# EAGLE design EIB32-JAE-HPC-v1 (EAGLE 9.4.2)
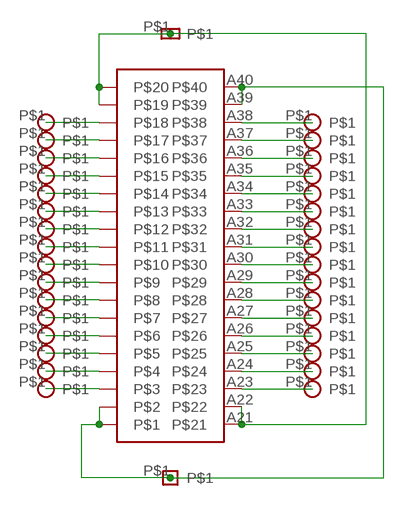
[diagram p0: schematic, sheet 1]

## Parts
U$1  WR-40SB-VFH30  [WR-40SB-VFH30]
U$2  EIB-GND-HOLE-PAD-SMALL  [EIB-GND-HOLE-PAD-SMALL]
U$3  EIB-GND-HOLE-PAD  [EIB-GND-HOLE-PAD]
U$5  EIB-TETRODE-HOLE-RS-PAD  [EIB-TETRODE-HOLE-RS-PAD]
U$6  EIB-TETRODE-HOLE-RS-PAD  [EIB-TETRODE-HOLE-RS-PAD]
U$7  EIB-TETRODE-HOLE-RS-PAD  [EIB-TETRODE-HOLE-RS-PAD]
U$8  EIB-TETRODE-HOLE-RS-PAD  [EIB-TETRODE-HOLE-RS-PAD]
U$9  EIB-TETRODE-HOLE-RS-PAD  [EIB-TETRODE-HOLE-RS-PAD]
U$10  EIB-TETRODE-HOLE-RS-PAD  [EIB-TETRODE-HOLE-RS-PAD]
U$11  EIB-TETRODE-HOLE-RS-PAD  [EIB-TETRODE-HOLE-RS-PAD]
U$12  EIB-TETRODE-HOLE-RS-PAD  [EIB-TETRODE-HOLE-RS-PAD]
U$13  EIB-TETRODE-HOLE-RS-PAD  [EIB-TETRODE-HOLE-RS-PAD]
U$14  EIB-TETRODE-HOLE-RS-PAD  [EIB-TETRODE-HOLE-RS-PAD]
U$15  EIB-TETRODE-HOLE-RS-PAD  [EIB-TETRODE-HOLE-RS-PAD]
U$16  EIB-TETRODE-HOLE-RS-PAD  [EIB-TETRODE-HOLE-RS-PAD]
U$17  EIB-TETRODE-HOLE-RS-PAD  [EIB-TETRODE-HOLE-RS-PAD]
U$18  EIB-TETRODE-HOLE-RS-PAD  [EIB-TETRODE-HOLE-RS-PAD]
U$19  EIB-TETRODE-HOLE-RS-PAD  [EIB-TETRODE-HOLE-RS-PAD]
U$20  EIB-TETRODE-HOLE-RS-PAD  [EIB-TETRODE-HOLE-RS-PAD]
U$23  EIB-TETRODE-HOLE-RS-PAD  [EIB-TETRODE-HOLE-RS-PAD]
U$24  EIB-TETRODE-HOLE-RS-PAD  [EIB-TETRODE-HOLE-RS-PAD]
U$25  EIB-TETRODE-HOLE-RS-PAD  [EIB-TETRODE-HOLE-RS-PAD]
U$26  EIB-TETRODE-HOLE-RS-PAD  [EIB-TETRODE-HOLE-RS-PAD]
U$27  EIB-TETRODE-HOLE-RS-PAD  [EIB-TETRODE-HOLE-RS-PAD]
U$28  EIB-TETRODE-HOLE-RS-PAD  [EIB-TETRODE-HOLE-RS-PAD]
U$29  EIB-TETRODE-HOLE-RS-PAD  [EIB-TETRODE-HOLE-RS-PAD]
U$30  EIB-TETRODE-HOLE-RS-PAD  [EIB-TETRODE-HOLE-RS-PAD]
U$31  EIB-TETRODE-HOLE-RS-PAD  [EIB-TETRODE-HOLE-RS-PAD]
U$32  EIB-TETRODE-HOLE-RS-PAD  [EIB-TETRODE-HOLE-RS-PAD]
U$33  EIB-TETRODE-HOLE-RS-PAD  [EIB-TETRODE-HOLE-RS-PAD]
U$34  EIB-TETRODE-HOLE-RS-PAD  [EIB-TETRODE-HOLE-RS-PAD]
U$35  EIB-TETRODE-HOLE-RS-PAD  [EIB-TETRODE-HOLE-RS-PAD]
U$36  EIB-TETRODE-HOLE-RS-PAD  [EIB-TETRODE-HOLE-RS-PAD]
U$37  EIB-TETRODE-HOLE-RS-PAD  [EIB-TETRODE-HOLE-RS-PAD]
U$38  EIB-TETRODE-HOLE-RS-PAD  [EIB-TETRODE-HOLE-RS-PAD]

## Nets
N$1: U$1.A19 U$1.A20 U$1.A21 U$1.A22 U$2.P$1
N$3: U$1.A1 U$1.A2 U$1.A39 U$1.A40 U$3.P$1
N$6: U$1.A18 U$5.P$1
N$7: U$1.A17 U$6.P$1
N$8: U$1.A16 U$7.P$1
N$9: U$1.A15 U$8.P$1
N$10: U$1.A14 U$9.P$1
N$11: U$1.A13 U$10.P$1
N$12: U$1.A12 U$11.P$1
N$13: U$1.A11 U$12.P$1
N$14: U$1.A10 U$13.P$1
N$15: U$1.A9 U$14.P$1
N$16: U$1.A8 U$15.P$1
N$17: U$1.A7 U$16.P$1
N$18: U$1.A6 U$17.P$1
N$19: U$1.A5 U$18.P$1
N$20: U$1.A4 U$19.P$1
N$21: U$1.A3 U$20.P$1
N$24: U$1.A38 U$23.P$1
N$25: U$1.A37 U$24.P$1
N$26: U$1.A36 U$25.P$1
N$27: U$1.A35 U$26.P$1
N$28: U$1.A34 U$27.P$1
N$29: U$1.A33 U$28.P$1
N$30: U$1.A32 U$29.P$1
N$31: U$1.A31 U$30.P$1
N$32: U$1.A30 U$31.P$1
N$33: U$1.A29 U$32.P$1
N$34: U$1.A28 U$33.P$1
N$35: U$1.A27 U$34.P$1
N$36: U$1.A26 U$35.P$1
N$37: U$1.A25 U$36.P$1
N$38: U$1.A24 U$37.P$1
N$39: U$1.A23 U$38.P$1

## Library data of the parts
U$1 = EIBLibrary:WR-40SB-VFH30
U$2 = EIBLibrary:EIB-GND-HOLE-PAD-SMALL
U$3 = EIBLibrary:EIB-GND-HOLE-PAD
U$5-U$20 U$23-U$38 = EIBLibrary:EIB-TETRODE-HOLE-RS-PAD

## Board
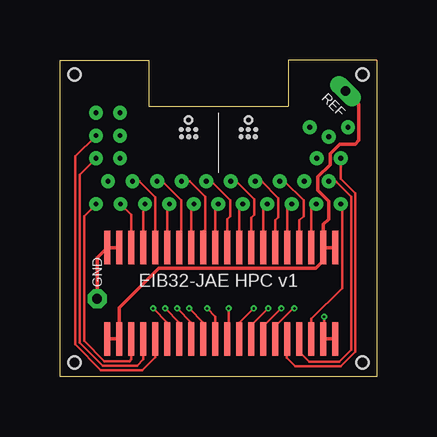
[diagram p1: board, top side]
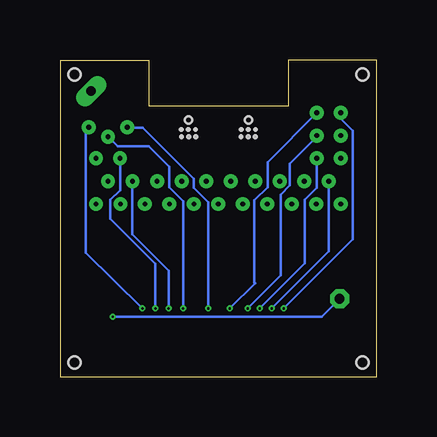
[diagram p2: board, bottom side, seen from below]

Size 13.2 x 13.2 mm. Coordinates in mm from the lower left corner, seen from the top.
Outline: 0,0 0,13.2 3.7,13.2 3.7,11.28 9.5,11.28 9.5,13.2 13.2,13.2 13.2,0 0,0
Copper layers (1*16): Top 0.012mm / dielectric 1.55mm / Bottom 0.012mm
Design rules "Multi-CB_2L_075um-Tracks_OL35um *": minimum track width 0.1mm, minimum drill 0.1mm, track to track 0.085mm, track to pad 0.085mm, pad to pad 0.085mm, via to via 0.085mm, smd to smd 0mil, copper to edge 0.2mm, drill to drill 0.2mm, minimum pad ring 0.125mm, minimum via ring 0.075mm, stop-mask expansion 2mil, vias tented up to drill 0.45mm, thermal gap 0.2mm
Holes 0.5 mm at 12.6,12.6 0.6,0.6 12.6,0.6 0.6,12.6
Holes 0.1 mm at 7.85,10.3 8.15,10.3 7.84,10 7.55,10.3 8.14,10 7.54,10 5.35,10.3 5.05,10.3 5.36,10 5.65,10.3 5.06,10 5.66,10
Holes 0.3 mm at 7.85,10.7 5.35,10.7

### Footprints (pad centres in the part's own frame; a part is rotated, then mirrored left to right if it is on the bottom)
WR-40SB-VFH30 = smd 0.25 x 1.4: A1 0,0; A2 0.5,0; A3 1,0; A4 1.5,0; A5 2,0; A6 2.5,0; A7 3,0; A8 3.5,0; A9 4,0; A10 4.5,0; A11 5,0; A12 5.5,0; A13 6,0; A14 6.5,0; A15 7,0; A16 7.5,0; A17 8,0; A18 8.5,0; A19 9,0; A20 9.5,0; A21 0,-3.8; A22 0.5,-3.8; A23 1,-3.8; A24 1.5,-3.8; A25 2,-3.8; A26 2.5,-3.8; A27 3,-3.8; A28 3.5,-3.8; A29 4,-3.8; A30 4.5,-3.8; A31 5,-3.8; A32 5.5,-3.8; A33 6,-3.8; A34 6.5,-3.8; A35 7,-3.8; A36 7.5,-3.8; A37 8,-3.8; A38 8.5,-3.8; A39 9,-3.8; A40 9.5,-3.8
EIB-GND-HOLE-PAD-SMALL = drill 0.4 pad 0.76 long: P$1 0,0
EIB-GND-HOLE-PAD = drill 0.4 pad 0.8 octagon: P$1 0,0
EIB-TETRODE-HOLE-RS-PAD = drill 0.2 pad 0.58: P$1 0,0

### Placement (x,y rotation side)
U$1  1.98,5.38 0 top
U$2  11.9,11.9 135 top
U$3  1.55,3.25 0 top
U$5  10.68,7.2 180 top
U$6  9.16,8.15 180 top
U$7  9.66,7.2 180 top
U$8  8.13,8.15 180 top
U$9  8.64,7.2 180 top
U$10  7.11,8.15 90 top
U$11  7.62,7.2 90 top
U$12  6.09,8.15 90 top
U$13  6.6,7.2 90 top
U$14  5.07,8.15 90 top
U$15  5.58,7.2 90 top
U$16  4.04,8.15 180 top
U$17  4.56,7.2 180 top
U$18  3.02,8.15 180 top
U$19  3.54,7.2 180 top
U$20  2.52,7.2 180 top
U$23  11.7,7.2 90 top
U$24  11.2,8.15 90 top
U$25  11.7,9.1 90 top
U$26  12,10.4 90 top
U$27  10.7,9.1 270 top
U$28  10.18,8.15 270 top
U$29  11.2,10 270 top
U$30  10.4,10.4 270 top
U$31  2.5,11 90 top
U$32  2.5,10.05 90 top
U$33  2.5,9.1 90 top
U$34  2,8.15 180 top
U$35  1.5,11 180 top
U$36  1.5,10.05 180 top
U$37  1.5,9.1 180 top
U$38  1.5,7.2 180 top

### Tracks (layer width: path | path; a pad name or v marks a point on that pad's centre or on a via)
N$1
  Top 0.1: U$1.A20 11.5,5.38 11.49,5.38 | 10.97,4.85 U$1.A19
  Top 0.15: U$2.P$1 12.45,11.35 12.45,9.85 12.3,9.7 11.66,9.7 11.25,9.29 11.25,8.84 10.75,8.34 10.75,7.77 11.2,7.32 11.2,6.58 10.97,6.35 U$1.A19 11.49,5.38 | U$1.A21 U$1.A22 2.48,2.88 4.12,4.52 10.67,4.52 10.97,4.83 10.97,4.85
N$3  (via drill 0.1)
  Top 0.1: v11,2.5 11,1.62 U$1.A39
  Top 0.15: U$3.P$1 1.55,4.96 U$1.A1 U$1.A2 | U$1.A39 U$1.A40
  Bottom 0.1: U$3.P$1 2.3,2.5 v11,2.5
N$6
  Top 0.1: U$1.A18 10.47,7 U$5.P$1
N$7
  Top 0.1: U$1.A17 9.97,6.53 10.15,6.7 10.15,7.35 9.35,8.15 U$6.P$1
N$8
  Top 0.1: U$1.A16 9.47,7.01 U$7.P$1
N$9
  Top 0.1: U$1.A15 8.97,6.53 9.1,6.65 9.1,7.45 8.4,8.15 U$8.P$1
N$10
  Top 0.1: U$1.A14 8.47,7.04 U$9.P$1
N$11
  Top 0.1: U$1.A13 7.97,6.62 8.1,6.75 8.1,7.4 7.35,8.15 U$10.P$1
N$12
  Top 0.1: U$1.A12 7.47,7.05 U$11.P$1
N$13
  Top 0.1: U$1.A11 6.97,6.58 7.1,6.7 7.1,7.35 6.3,8.15 U$12.P$1
N$14
  Top 0.1: U$1.A10 6.47,7.08 U$13.P$1
N$15
  Top 0.1: U$1.A9 5.97,6.08 6.05,6.15 6.05,7.5 5.4,8.15 U$14.P$1
N$16
  Top 0.1: U$1.A8 5.47,7.09 U$15.P$1
N$17
  Top 0.1: U$1.A7 4.97,6.03 5.05,6.1 5.05,7.35 4.25,8.15 U$16.P$1
N$18
  Top 0.1: U$1.A6 4.47,7.12 U$17.P$1
N$19
  Top 0.1: U$1.A5 3.98,7.47 3.3,8.15 U$18.P$1
N$20
  Top 0.1: U$1.A4 3.48,7.13 U$19.P$1
N$21
  Top 0.1: U$1.A3 2.98,6.75 U$20.P$1
N$24
  Top 0.1: U$1.A38 10.47,2.42 11.75,3.7 11.75,7.15 U$23.P$1
N$25
  Top 0.1: U$24.P$1 11.25,8.12 11.5,8.12 12.12,7.5 12.12,1.12 11.62,0.62 10.38,0.62 10,1 10,1.5 U$1.A37
N$26
  Top 0.1: U$25.P$1 11.7,8.25 12.31,7.64 12.31,1.05 11.7,0.44 9.81,0.44 9.45,0.8 9.45,1.55 U$1.A36
N$27  (via drill 0.1)
  Top 0.1: U$1.A35 8.97,2.1 9.73,2.85 v9.77,2.85
  Bottom 0.1: v9.77,2.85 12.12,5.17 12.12,10.28 U$26.P$1
N$28  (via drill 0.1)
  Top 0.1: v9.22,2.85 8.47,2.1 U$1.A34
  Bottom 0.1: v9.22,2.85 9.22,4.71 11.11,6.59 11.11,7.38 10.7,7.78 U$27.P$1
N$29  (via drill 0.1)
  Top 0.1: v8.68,2.85 7.97,2.15 U$1.A33
  Bottom 0.1: v8.68,2.85 8.68,4.42 10.2,5.95 10.2,8.13 U$28.P$1
N$30  (via drill 0.1)
  Top 0.1: v8.07,2.85 7.47,2.25 U$1.A32
  Bottom 0.1: v8.07,2.85 8.07,7.33 8.65,7.9 8.65,8.75 9.5,9.6 10.8,9.6 U$29.P$1
N$31  (via drill 0.1)
  Top 0.1: v7.03,2.85 7.03,1.63 U$1.A31
  Bottom 0.1: U$30.P$1 10.38,10.38 9.75,10.38 7.62,8.25 7.62,7.88 7.03,7.28 v7.03,2.85
N$32  (via drill 0.1)
  Top 0.1: v6.12,2.85 6.47,2.5 U$1.A30
  Bottom 0.1: v6.12,2.85 5.08,3.9 5.1,3.92 5.1,7.35 4.55,7.9 4.55,8.95 U$31.P$1
N$33  (via drill 0.1)
  Top 0.1: v5.38,2.85 5.97,2.25 U$1.A29
  Bottom 0.1: v5.38,2.85 4,4.22 4,7.59 3.62,7.97 3.62,8.88 2.5,10 U$32.P$1
N$34  (via drill 0.1)
  Top 0.1: v4.88,2.85 5.47,2.25 U$1.A28
  Bottom 0.1: U$33.P$1 2.5,7.88 3,7.38 3,4.72 v4.88,2.85
N$35  (via drill 0.1)
  Top 0.1: v4.38,2.85 4.97,2.25 U$1.A27
  Bottom 0.1: U$34.P$1 2,5.22 v4.38,2.85
N$36  (via drill 0.1)
  Top 0.1: v3.88,2.85 4.47,2.25 U$1.A26
  Bottom 0.1: U$35.P$1 1.5,10.75 1,10.25 1,5.72 v3.88,2.85
N$37
  Top 0.1: U$1.A25 3.98,0.82 3.43,0.28 1.7,0.28 0.63,1.35 0.63,9.18 U$36.P$1
N$38
  Top 0.1: U$1.A24 3.48,0.72 3.21,0.47 1.77,0.47 0.81,1.42 0.81,8.41 U$37.P$1
N$39
  Top 0.1: U$1.A23 2.98,0.72 2.9,0.65 1.85,0.65 1,1.5 1,6.7 U$38.P$1

### Text on the board
tPlace: REF | GND | EIB32-JAE HPC v1